# Altium project digital_power.PrjPcb (part 2 of 2)
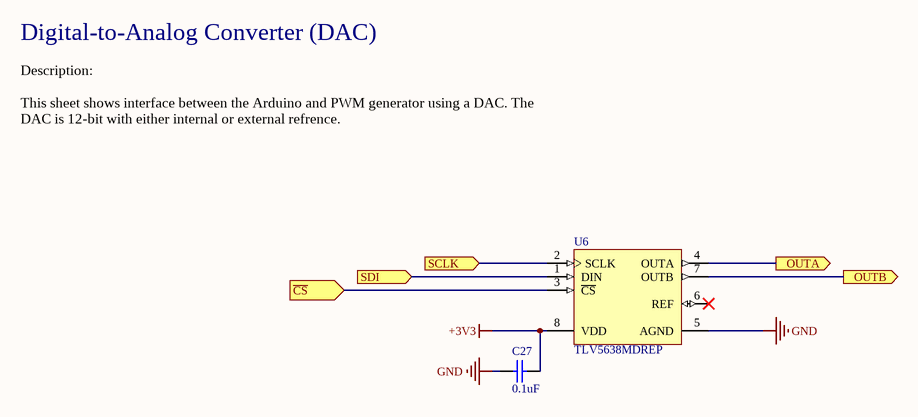
[diagram p7: dac.SchDoc]

## Nets that join several sheets
+3V3: power_stage (C10.1 U4.3), ArduinoUnoShield (POWER1.5), Driver/PWM Generator (C26_2.2 U5_2.4 U5_2.5), gate_driver (R12.2 R13.2 U1.17 U2.8), Driver/PWM Generator (C26_1.2 U5_1.4 U5_1.5), dac (C27.1 U6.8)
GND: power_stage (23 pins), ArduinoUnoShield (ICSP1.6 IOH1.7 POWER1.2 POWER1.3), Driver/PWM Generator (C26_2.1 R24_2.1 R25_2.1 U5_2.2), gate_driver (11 pins), Driver/PWM Generator (C26_1.1 R24_1.1 R25_1.1 U5_1.2), dac (C27.2 U6.5)
+supply: power_stage (10 pins), ArduinoUnoShield (P5.2), gate_driver (R4.2 R8.1)
HIA: Driver/PWM Generator (TP18_PWM_Generator2.1 U5_2.6), gate_driver (U1.7 U2.1)
HIB: gate_driver (U1.8 U2.3), Driver/PWM Generator (TP18_PWM_Generator1.1 U5_1.6)
MOSI: ArduinoUnoShield (IOH1.4 P1.2), dac (U6.1)
NetAD1_1: ArduinoUnoShield (AD1.1), driver (TP3.1), gate_driver (U1.3)
NetAD1_2: ArduinoUnoShield (AD1.2), driver (TP4.1), gate_driver (U1.12)
NetAD1_3: power_stage (R17.1 R18.2 TP14.1), ArduinoUnoShield (AD1.3)
NetAD1_4: power_stage (TP7.1 U4.6), ArduinoUnoShield (AD1.4)
NetAD1_5: power_stage (R22.1 R23.2 TP19.1), ArduinoUnoShield (AD1.5)
NetC2_2: power_stage (8 pins), gate_driver (C2.2 U1.28)
NetC3_2: power_stage (8 pins), gate_driver (C3.2 U1.20)
NetIOH1_3: ArduinoUnoShield (IOH1.3), dac (U6.3)
NetQ1_4: power_stage (Q1.4 TP12.1), gate_driver (R2.2)
NetQ2_4: power_stage (Q2.4 TP13.1), gate_driver (R9.2)
NetQ3_4: power_stage (Q3.4 TP15.1), gate_driver (R5.2)
NetQ4_4: power_stage (Q4.4 TP16.1), gate_driver (R6.2)
NetTP17_PWM_Generator1_1: Driver/PWM Generator (TP17_PWM_Generator1.1 U5_1.1), dac (U6.7)
NetTP17_PWM_Generator2_1: Driver/PWM Generator (TP17_PWM_Generator2.1 U5_2.1), dac (U6.4)
OVP: ArduinoUnoShield (IOH1.1), driver (TP2.1), gate_driver (R13.1 U1.15)
PGOOD: ArduinoUnoShield (IOH1.2), driver (TP1.1), gate_driver (R12.1 U1.10)
SA_N: power_stage (5 pins), gate_driver (R3.1)
SA_P: power_stage (10 pins), gate_driver (C7.1 R1.1 U3.1 U3.3)
SB_P: power_stage (5 pins), gate_driver (R10.1)
SCK: ArduinoUnoShield (IOH1.6 P1.3), dac (U6.2)